# EAGLE schematic additional-hardware (EAGLE 6.6.0)
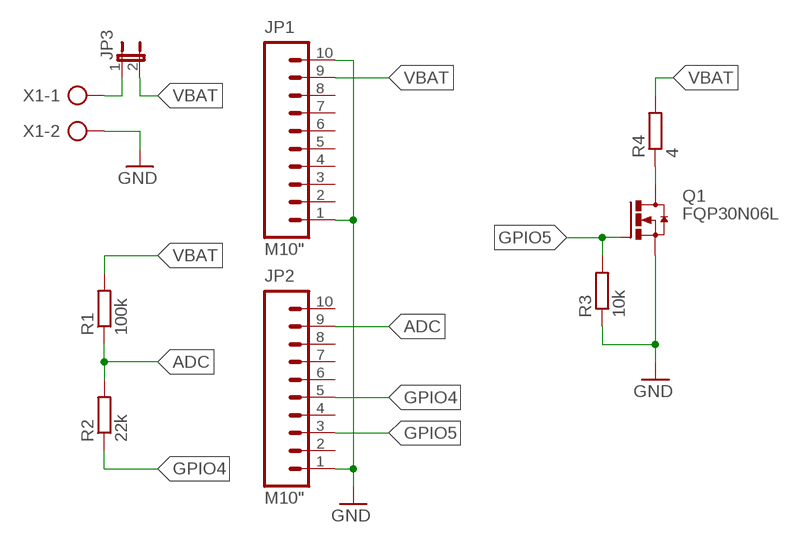
[diagram p0: schematic, sheet 1]

## Parts
JP1  M10"  [1X10]
JP2  M10"  [1X10]
JP3  JP1E  [JP1]
Q1  FQP30N06L  IRFP251  [TO-247AD-V]
R1  100k  R-EU_0309/12  [0309/12]
R2  22k  R-EU_0309/12  [0309/12]
R3  10k  R-EU_0309/12  [0309/12]
R4  4  R-EU_0309/12  [0309/12]
X1  AK500/2-H  [AK500/2-H]

## Nets
ADC: JP2.9
GND: JP1.1 JP1.10 JP2.1 Q1.S R3.1 X1.2
GPIO4: JP2.5
GPIO5: JP2.3
N$1: R1.1 R2.2
N$2: R2.1
N$3: R1.2
N$4: Q1.D R4.1
N$5: Q1.G R3.2
N$6: R4.2
N$7: JP3.1 X1.1
N$8: JP3.2
VBAT: JP1.9
Unconnected: JP1.2 JP1.3 JP1.4 JP1.5 JP1.6 JP1.7 JP1.8 JP2.2 JP2.4 JP2.6 JP2.7 JP2.8 JP2.10

## Library data of the parts
JP1 JP2 = SparkFun-Connectors:M10: Header 10 Standard 10-pin 0.1" header. Use with straight break away headers (SKU : PRT-00116), right angle break away headers (PRT-00553), swiss pins (PRT-00743), machine pins (PRT-00117), and female headers (PRT-00115).
JP3 = jumper:JP1E: JUMPER
Q1 = transistor-power:IRFP25*: 33A/27A, 200V/150V, 0.085/0.012 Ohm, N-Channel Power MOSFET Source: Fairchild Semiconductor Corporation
R1-R4 = resistor:R-EU_: RESISTOR, European symbol
X1 = con-ptr500:AK500/2-H: CONNECTOR Aug. 2004 / PTR Meßtechnik: Die Bezeichnung der Serie AK505 wurde geändert. Es handelt sich hierbei um AK500 in horizontaler Ausführung.; OC_FARNELL: unknown; OC_NEWARK: unknown